# EAGLE schematic 0606_RGB_Clock (EAGLE 5.10)

## Sheet 1 of 3
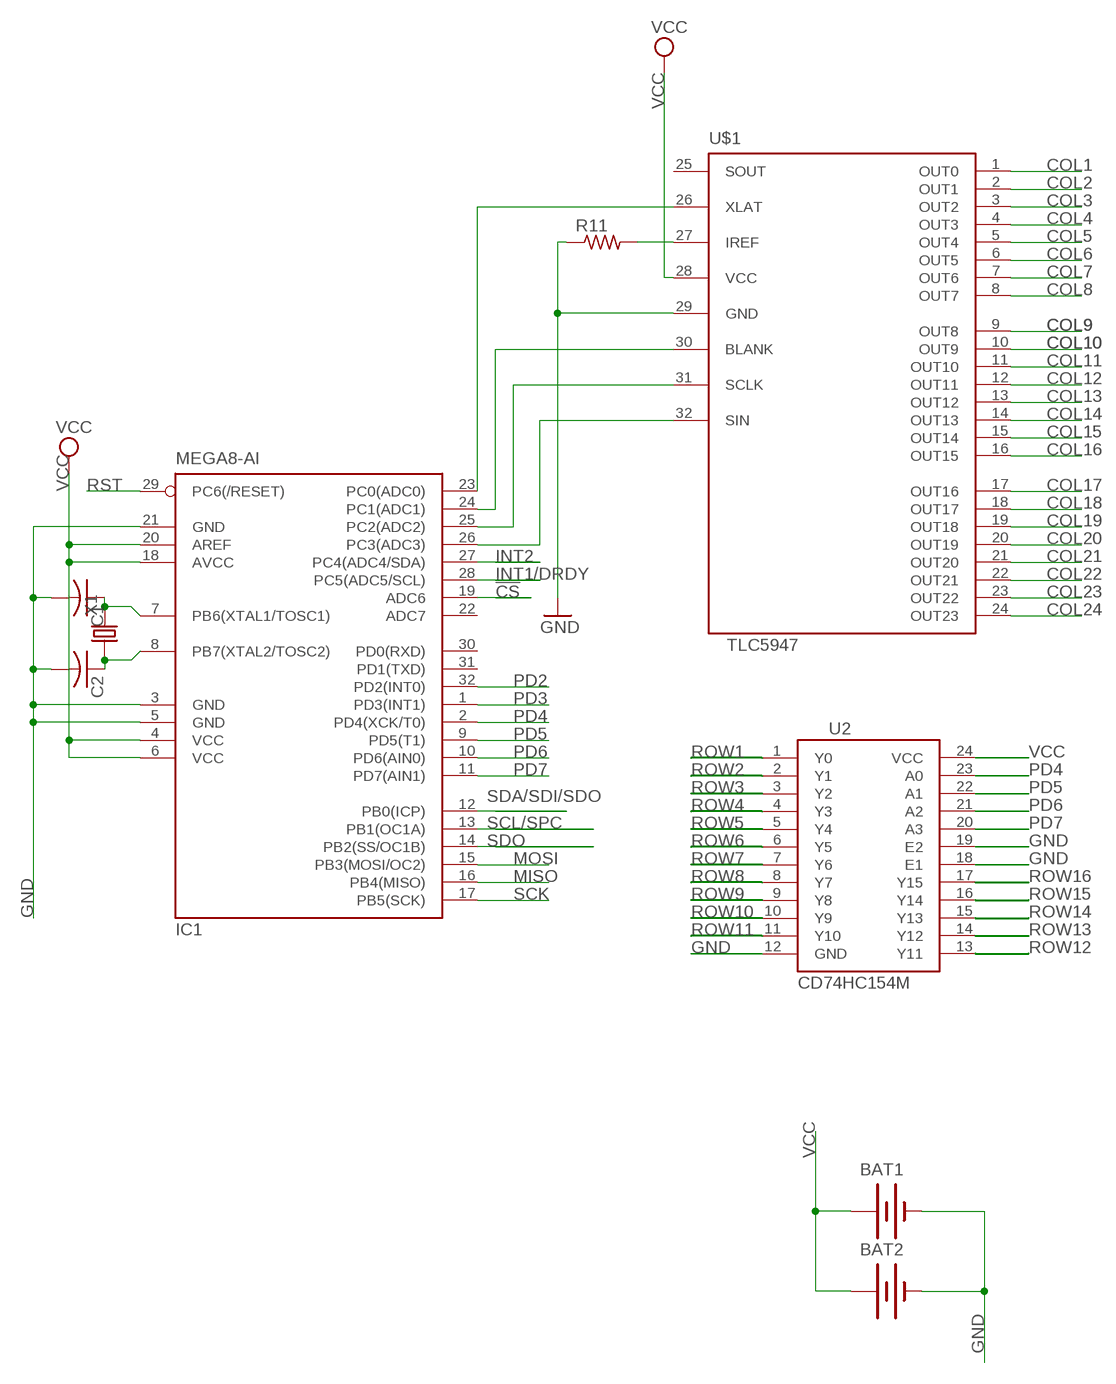
[diagram p0: schematic, sheet 1]

### Parts
BAT1  BATTERY20SMD  [BATTCON_20MM]
BAT2  BATTERY20SMD  [BATTCON_20MM]
C1  C-USC0805  [C0805]
C2  C-USC0805  [C0805]
IC1  MEGA8-AI  [TQFP32-08]
R11  R-US_R0805  [R0805]
U2  CD74HC154M  [SO-24DW]
U$1  TLC5947  [QFN32]
X1  CRYSTAL-5032  [5032]

### Nets
!CS: IC1.19(ADC6) ; also sheet 3
COL1: U$1.1(OUT0) ; also sheet 2
COL2: U$1.2(OUT1) ; also sheet 2
COL3: U$1.3(OUT2) ; also sheet 2
COL4: U$1.4(OUT3) ; also sheet 2
COL5: U$1.5(OUT4) ; also sheet 2
COL6: U$1.6(OUT5) ; also sheet 2
COL7: U$1.7(OUT6) ; also sheet 2
COL8: U$1.8(OUT7) ; also sheet 2
COL9: U$1.9(OUT8) ; also sheet 2
COL10: U$1.10(OUT9) ; also sheet 2
COL11: U$1.11(OUT10) ; also sheet 2
COL12: U$1.12(OUT11) ; also sheet 2
COL13: U$1.13(OUT12) ; also sheet 2
COL14: U$1.14(OUT13) ; also sheet 2
COL15: U$1.15(OUT14) ; also sheet 2
COL16: U$1.16(OUT15) ; also sheet 2
COL17: U$1.17(OUT16) ; also sheet 2
COL18: U$1.18(OUT17) ; also sheet 2
COL19: U$1.19(OUT18) ; also sheet 2
COL20: U$1.20(OUT19) ; also sheet 2
COL21: U$1.21(OUT20) ; also sheet 2
COL22: U$1.22(OUT21) ; also sheet 2
COL23: U$1.23(OUT22) ; also sheet 2
COL24: U$1.24(OUT23) ; also sheet 2
GND: BAT1.2(-) BAT2.2(-) C1.2 C2.2 IC1.3(GND) IC1.5(GND) IC1.21(GND) R11.1 U2.12(GND) U2.18(E1) U2.19(E2) U$1.29(GND) ; also sheet 3
INT1/DRDY: IC1.28(PC5(ADC5/SCL)) ; also sheet 3
INT2: IC1.27(PC4(ADC4/SDA)) ; also sheet 3
MISO: IC1.16(PB4(MISO)) ; also sheet 3
MOSI: IC1.15(PB3(MOSI/OC2)) ; also sheet 3
N$7: C1.1 IC1.7(PB6(XTAL1/TOSC1)) X1.2
N$8: C2.1 IC1.8(PB7(XTAL2/TOSC2)) X1.1
N$9: IC1.23(PC0(ADC0)) U$1.26(XLAT)
N$10: IC1.24(PC1(ADC1)) U$1.30(BLANK)
N$11: IC1.25(PC2(ADC2)) U$1.31(SCLK)
N$12: IC1.26(PC3(ADC3)) U$1.32(SIN)
N$13: R11.2 U$1.27(IREF)
PD2: IC1.32(PD2(INT0)) ; also sheet 3
PD3: IC1.1(PD3(INT1)) ; also sheet 3
PD4: IC1.2(PD4(XCK/T0)) U2.23(A0)
PD5: IC1.9(PD5(T1)) U2.22(A1)
PD6: IC1.10(PD6(AIN0)) U2.21(A2)
PD7: IC1.11(PD7(AIN1)) U2.20(A3)
ROW1: U2.1(Y0) ; also sheet 2
ROW2: U2.2(Y1) ; also sheet 2
ROW3: U2.3(Y2) ; also sheet 2
ROW4: U2.4(Y3) ; also sheet 2
ROW5: U2.5(Y4) ; also sheet 2
ROW6: U2.6(Y5) ; also sheet 2
ROW7: U2.7(Y6) ; also sheet 2
ROW8: U2.8(Y7) ; also sheet 2
ROW9: U2.9(Y8) ; also sheet 2
ROW10: U2.10(Y9)
ROW11: U2.11(Y10)
ROW12: U2.13(Y11)
ROW13: U2.14(Y12)
ROW14: U2.15(Y13)
ROW15: U2.16(Y14)
ROW16: U2.17(Y15)
RST: IC1.29(PC6(/RESET)) ; also sheet 3
SCK: IC1.17(PB5(SCK)) ; also sheet 3
SCL/SPC: IC1.13(PB1(OC1A)) ; also sheet 3
SDA/SDI/SDO: IC1.12(PB0(ICP)) ; also sheet 3
SDO: IC1.14(PB2(SS/OC1B)) ; also sheet 3
VCC: BAT1.1(+) BAT2.1(+) IC1.4(VCC) IC1.6(VCC) IC1.18(AVCC) IC1.20(AREF) U2.24(VCC) U$1.28(VCC) ; also sheet 2,3
Unconnected: IC1.22(ADC7) IC1.30(PD0(RXD)) IC1.31(PD1(TXD)) U$1.25(SOUT)

## Sheet 2 of 3
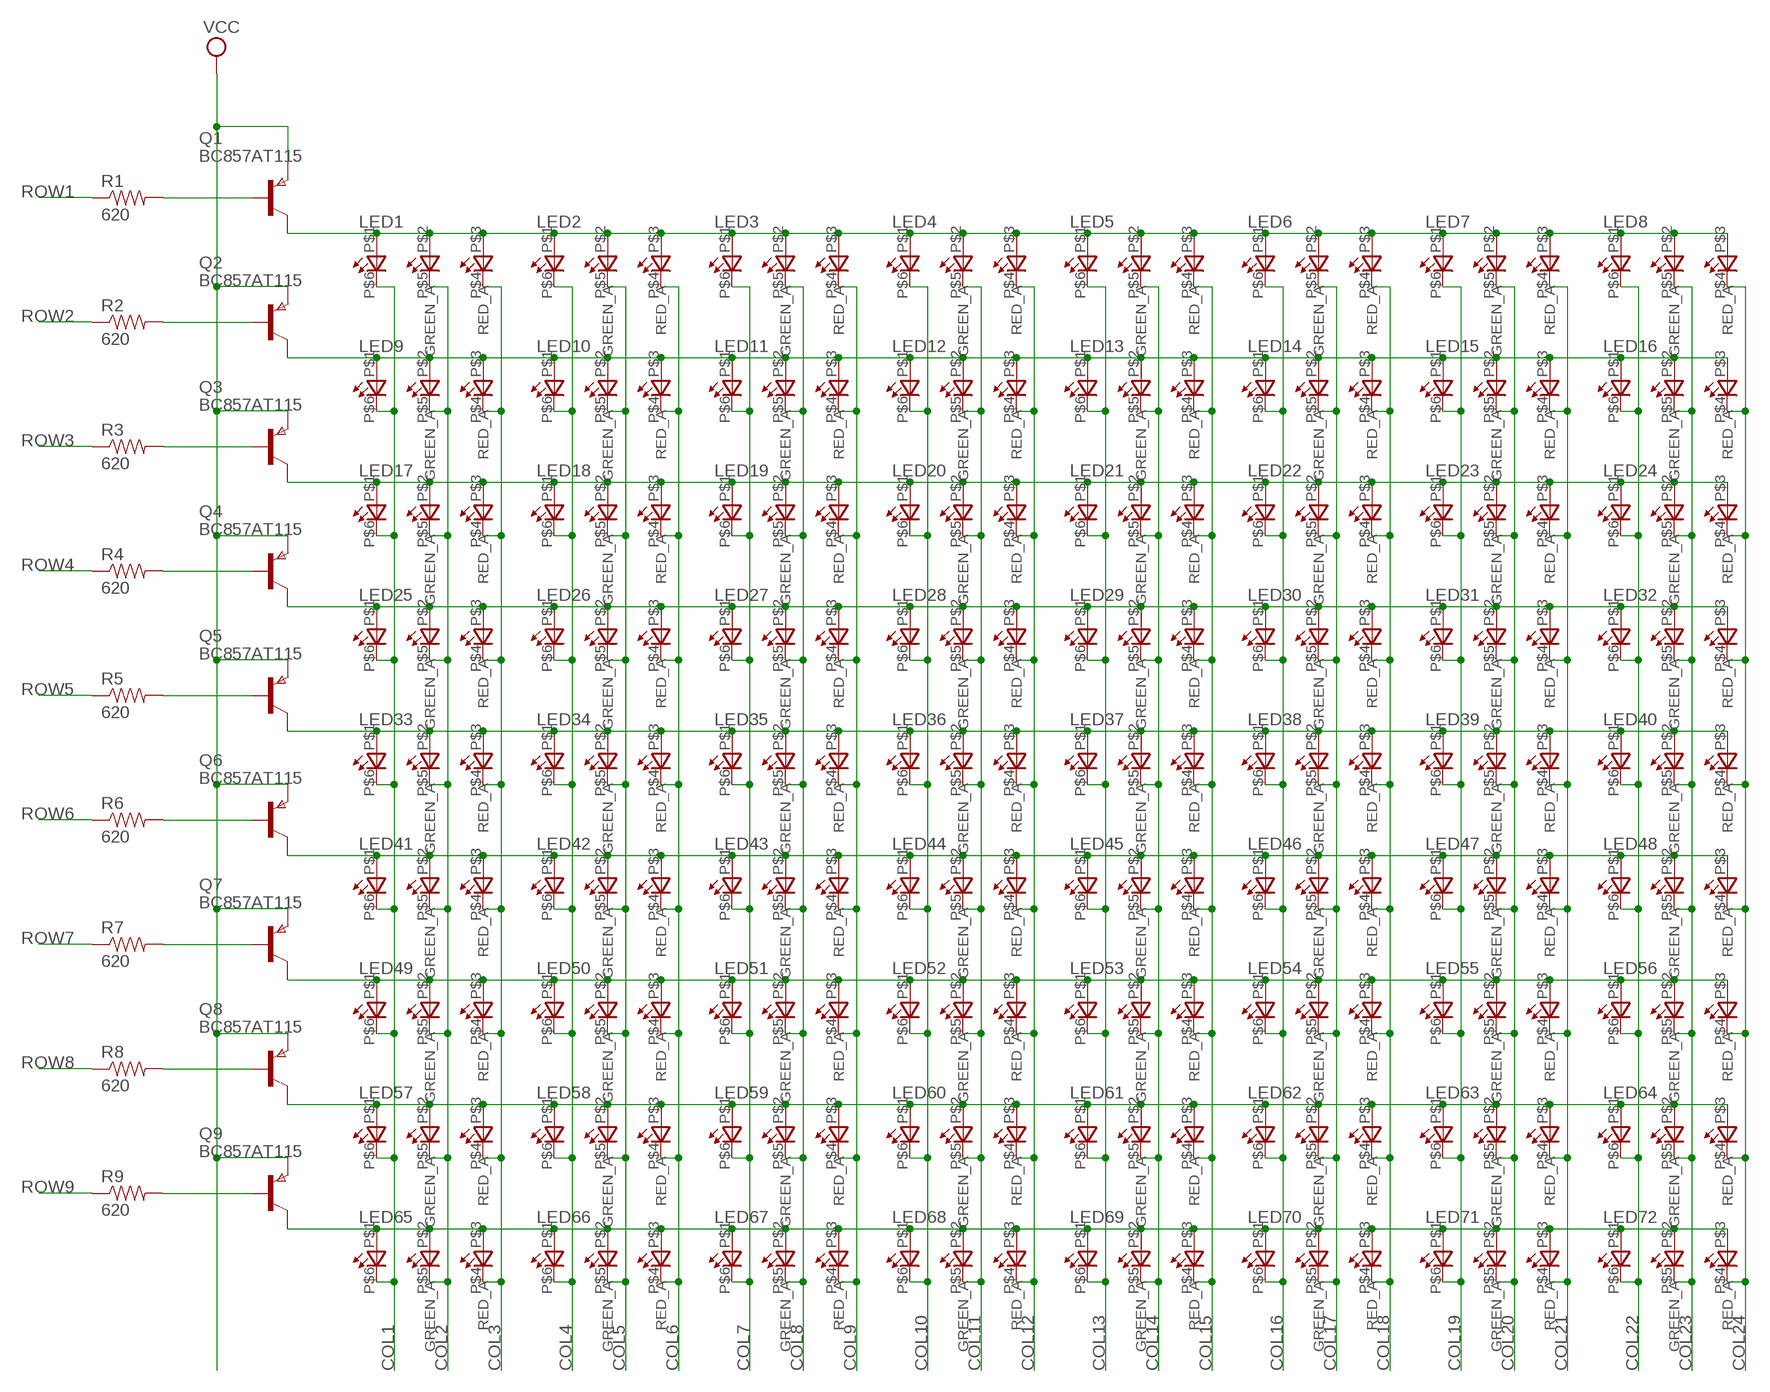
[diagram p1: schematic, sheet 2]

### Parts
LED1  0606_RGB_LED  [0606_LED]
LED2  0606_RGB_LED  [0606_LED]
LED3  0606_RGB_LED  [0606_LED]
LED4  0606_RGB_LED  [0606_LED]
LED5  0606_RGB_LED  [0606_LED]
LED6  0606_RGB_LED  [0606_LED]
LED7  0606_RGB_LED  [0606_LED]
LED8  0606_RGB_LED  [0606_LED]
LED9  0606_RGB_LED  [0606_LED]
LED10  0606_RGB_LED  [0606_LED]
LED11  0606_RGB_LED  [0606_LED]
LED12  0606_RGB_LED  [0606_LED]
LED13  0606_RGB_LED  [0606_LED]
LED14  0606_RGB_LED  [0606_LED]
LED15  0606_RGB_LED  [0606_LED]
LED16  0606_RGB_LED  [0606_LED]
LED17  0606_RGB_LED  [0606_LED]
LED18  0606_RGB_LED  [0606_LED]
LED19  0606_RGB_LED  [0606_LED]
LED20  0606_RGB_LED  [0606_LED]
LED21  0606_RGB_LED  [0606_LED]
LED22  0606_RGB_LED  [0606_LED]
LED23  0606_RGB_LED  [0606_LED]
LED24  0606_RGB_LED  [0606_LED]
LED25  0606_RGB_LED  [0606_LED]
LED26  0606_RGB_LED  [0606_LED]
LED27  0606_RGB_LED  [0606_LED]
LED28  0606_RGB_LED  [0606_LED]
LED29  0606_RGB_LED  [0606_LED]
LED30  0606_RGB_LED  [0606_LED]
LED31  0606_RGB_LED  [0606_LED]
LED32  0606_RGB_LED  [0606_LED]
LED33  0606_RGB_LED  [0606_LED]
LED34  0606_RGB_LED  [0606_LED]
LED35  0606_RGB_LED  [0606_LED]
LED36  0606_RGB_LED  [0606_LED]
LED37  0606_RGB_LED  [0606_LED]
LED38  0606_RGB_LED  [0606_LED]
LED39  0606_RGB_LED  [0606_LED]
LED40  0606_RGB_LED  [0606_LED]
LED41  0606_RGB_LED  [0606_LED]
LED42  0606_RGB_LED  [0606_LED]
LED43  0606_RGB_LED  [0606_LED]
LED44  0606_RGB_LED  [0606_LED]
LED45  0606_RGB_LED  [0606_LED]
LED46  0606_RGB_LED  [0606_LED]
LED47  0606_RGB_LED  [0606_LED]
LED48  0606_RGB_LED  [0606_LED]
LED49  0606_RGB_LED  [0606_LED]
LED50  0606_RGB_LED  [0606_LED]
LED51  0606_RGB_LED  [0606_LED]
LED52  0606_RGB_LED  [0606_LED]
LED53  0606_RGB_LED  [0606_LED]
LED54  0606_RGB_LED  [0606_LED]
LED55  0606_RGB_LED  [0606_LED]
LED56  0606_RGB_LED  [0606_LED]
LED57  0606_RGB_LED  [0606_LED]
LED58  0606_RGB_LED  [0606_LED]
LED59  0606_RGB_LED  [0606_LED]
LED60  0606_RGB_LED  [0606_LED]
LED61  0606_RGB_LED  [0606_LED]
LED62  0606_RGB_LED  [0606_LED]
LED63  0606_RGB_LED  [0606_LED]
LED64  0606_RGB_LED  [0606_LED]
LED65  0606_RGB_LED  [0606_LED]
LED66  0606_RGB_LED  [0606_LED]
LED67  0606_RGB_LED  [0606_LED]
LED68  0606_RGB_LED  [0606_LED]
LED69  0606_RGB_LED  [0606_LED]
LED70  0606_RGB_LED  [0606_LED]
LED71  0606_RGB_LED  [0606_LED]
LED72  0606_RGB_LED  [0606_LED]
Q1  BC857AT115  PNPSOT323SOT416  [SOT416]
Q2  BC857AT115  PNPSOT323SOT416  [SOT416]
Q3  BC857AT115  PNPSOT323SOT416  [SOT416]
Q4  BC857AT115  PNPSOT323SOT416  [SOT416]
Q5  BC857AT115  PNPSOT323SOT416  [SOT416]
Q6  BC857AT115  PNPSOT323SOT416  [SOT416]
Q7  BC857AT115  PNPSOT323SOT416  [SOT416]
Q8  BC857AT115  PNPSOT323SOT416  [SOT416]
Q9  BC857AT115  PNPSOT323SOT416  [SOT416]
R1  620  SPARKFUN_RESISTOR0603-RES  [SPARKFUN_0603-RES]
R2  620  SPARKFUN_RESISTOR0603-RES  [SPARKFUN_0603-RES]
R3  620  SPARKFUN_RESISTOR0603-RES  [SPARKFUN_0603-RES]
R4  620  SPARKFUN_RESISTOR0603-RES  [SPARKFUN_0603-RES]
R5  620  SPARKFUN_RESISTOR0603-RES  [SPARKFUN_0603-RES]
R6  620  SPARKFUN_RESISTOR0603-RES  [SPARKFUN_0603-RES]
R7  620  SPARKFUN_RESISTOR0603-RES  [SPARKFUN_0603-RES]
R8  620  SPARKFUN_RESISTOR0603-RES  [SPARKFUN_0603-RES]
R9  620  SPARKFUN_RESISTOR0603-RES  [SPARKFUN_0603-RES]

### Nets
COL1: LED1.P$6(C_BLUE) LED9.P$6(C_BLUE) LED17.P$6(C_BLUE) LED25.P$6(C_BLUE) LED33.P$6(C_BLUE) LED41.P$6(C_BLUE) LED49.P$6(C_BLUE) LED57.P$6(C_BLUE) LED65.P$6(C_BLUE) ; also sheet 1
COL2: LED1.P$5(C_GREEN) LED9.P$5(C_GREEN) LED17.P$5(C_GREEN) LED25.P$5(C_GREEN) LED33.P$5(C_GREEN) LED41.P$5(C_GREEN) LED49.P$5(C_GREEN) LED57.P$5(C_GREEN) LED65.P$5(C_GREEN) ; also sheet 1
COL3: LED1.P$4(C_RED) LED9.P$4(C_RED) LED17.P$4(C_RED) LED25.P$4(C_RED) LED33.P$4(C_RED) LED41.P$4(C_RED) LED49.P$4(C_RED) LED57.P$4(C_RED) LED65.P$4(C_RED) ; also sheet 1
COL4: LED2.P$6(C_BLUE) LED10.P$6(C_BLUE) LED18.P$6(C_BLUE) LED26.P$6(C_BLUE) LED34.P$6(C_BLUE) LED42.P$6(C_BLUE) LED50.P$6(C_BLUE) LED58.P$6(C_BLUE) LED66.P$6(C_BLUE) ; also sheet 1
COL5: LED2.P$5(C_GREEN) LED10.P$5(C_GREEN) LED18.P$5(C_GREEN) LED26.P$5(C_GREEN) LED34.P$5(C_GREEN) LED42.P$5(C_GREEN) LED50.P$5(C_GREEN) LED58.P$5(C_GREEN) LED66.P$5(C_GREEN) ; also sheet 1
COL6: LED2.P$4(C_RED) LED10.P$4(C_RED) LED18.P$4(C_RED) LED26.P$4(C_RED) LED34.P$4(C_RED) LED42.P$4(C_RED) LED50.P$4(C_RED) LED58.P$4(C_RED) LED66.P$4(C_RED) ; also sheet 1
COL7: LED3.P$6(C_BLUE) LED11.P$6(C_BLUE) LED19.P$6(C_BLUE) LED27.P$6(C_BLUE) LED35.P$6(C_BLUE) LED43.P$6(C_BLUE) LED51.P$6(C_BLUE) LED59.P$6(C_BLUE) LED67.P$6(C_BLUE) ; also sheet 1
COL8: LED3.P$5(C_GREEN) LED11.P$5(C_GREEN) LED19.P$5(C_GREEN) LED27.P$5(C_GREEN) LED35.P$5(C_GREEN) LED43.P$5(C_GREEN) LED51.P$5(C_GREEN) LED59.P$5(C_GREEN) LED67.P$5(C_GREEN) ; also sheet 1
COL9: LED3.P$4(C_RED) LED11.P$4(C_RED) LED19.P$4(C_RED) LED27.P$4(C_RED) LED35.P$4(C_RED) LED43.P$4(C_RED) LED51.P$4(C_RED) LED59.P$4(C_RED) LED67.P$4(C_RED) ; also sheet 1
COL10: LED4.P$6(C_BLUE) LED12.P$6(C_BLUE) LED20.P$6(C_BLUE) LED28.P$6(C_BLUE) LED36.P$6(C_BLUE) LED44.P$6(C_BLUE) LED52.P$6(C_BLUE) LED60.P$6(C_BLUE) LED68.P$6(C_BLUE) ; also sheet 1
COL11: LED4.P$5(C_GREEN) LED12.P$5(C_GREEN) LED20.P$5(C_GREEN) LED28.P$5(C_GREEN) LED36.P$5(C_GREEN) LED44.P$5(C_GREEN) LED52.P$5(C_GREEN) LED60.P$5(C_GREEN) LED68.P$5(C_GREEN) ; also sheet 1
COL12: LED4.P$4(C_RED) LED12.P$4(C_RED) LED20.P$4(C_RED) LED28.P$4(C_RED) LED36.P$4(C_RED) LED44.P$4(C_RED) LED52.P$4(C_RED) LED60.P$4(C_RED) LED68.P$4(C_RED) ; also sheet 1
COL13: LED5.P$6(C_BLUE) LED13.P$6(C_BLUE) LED21.P$6(C_BLUE) LED29.P$6(C_BLUE) LED37.P$6(C_BLUE) LED45.P$6(C_BLUE) LED53.P$6(C_BLUE) LED61.P$6(C_BLUE) LED69.P$6(C_BLUE) ; also sheet 1
COL14: LED5.P$5(C_GREEN) LED13.P$5(C_GREEN) LED21.P$5(C_GREEN) LED29.P$5(C_GREEN) LED37.P$5(C_GREEN) LED45.P$5(C_GREEN) LED53.P$5(C_GREEN) LED61.P$5(C_GREEN) LED69.P$5(C_GREEN) ; also sheet 1
COL15: LED5.P$4(C_RED) LED13.P$4(C_RED) LED21.P$4(C_RED) LED29.P$4(C_RED) LED37.P$4(C_RED) LED45.P$4(C_RED) LED53.P$4(C_RED) LED61.P$4(C_RED) LED69.P$4(C_RED) ; also sheet 1
COL16: LED6.P$6(C_BLUE) LED14.P$6(C_BLUE) LED22.P$6(C_BLUE) LED30.P$6(C_BLUE) LED38.P$6(C_BLUE) LED46.P$6(C_BLUE) LED54.P$6(C_BLUE) LED62.P$6(C_BLUE) LED70.P$6(C_BLUE) ; also sheet 1
COL17: LED6.P$5(C_GREEN) LED14.P$5(C_GREEN) LED22.P$5(C_GREEN) LED30.P$5(C_GREEN) LED38.P$5(C_GREEN) LED46.P$5(C_GREEN) LED54.P$5(C_GREEN) LED62.P$5(C_GREEN) LED70.P$5(C_GREEN) ; also sheet 1
COL18: LED6.P$4(C_RED) LED14.P$4(C_RED) LED22.P$4(C_RED) LED30.P$4(C_RED) LED38.P$4(C_RED) LED46.P$4(C_RED) LED54.P$4(C_RED) LED62.P$4(C_RED) LED70.P$4(C_RED) ; also sheet 1
COL19: LED7.P$6(C_BLUE) LED15.P$6(C_BLUE) LED23.P$6(C_BLUE) LED31.P$6(C_BLUE) LED39.P$6(C_BLUE) LED47.P$6(C_BLUE) LED55.P$6(C_BLUE) LED63.P$6(C_BLUE) LED71.P$6(C_BLUE) ; also sheet 1
COL20: LED7.P$5(C_GREEN) LED15.P$5(C_GREEN) LED23.P$5(C_GREEN) LED31.P$5(C_GREEN) LED39.P$5(C_GREEN) LED47.P$5(C_GREEN) LED55.P$5(C_GREEN) LED63.P$5(C_GREEN) LED71.P$5(C_GREEN) ; also sheet 1
COL21: LED7.P$4(C_RED) LED15.P$4(C_RED) LED23.P$4(C_RED) LED31.P$4(C_RED) LED39.P$4(C_RED) LED47.P$4(C_RED) LED55.P$4(C_RED) LED63.P$4(C_RED) LED71.P$4(C_RED) ; also sheet 1
COL22: LED8.P$6(C_BLUE) LED16.P$6(C_BLUE) LED24.P$6(C_BLUE) LED32.P$6(C_BLUE) LED40.P$6(C_BLUE) LED48.P$6(C_BLUE) LED56.P$6(C_BLUE) LED64.P$6(C_BLUE) LED72.P$6(C_BLUE) ; also sheet 1
COL23: LED8.P$5(C_GREEN) LED16.P$5(C_GREEN) LED24.P$5(C_GREEN) LED32.P$5(C_GREEN) LED40.P$5(C_GREEN) LED48.P$5(C_GREEN) LED56.P$5(C_GREEN) LED64.P$5(C_GREEN) LED72.P$5(C_GREEN) ; also sheet 1
COL24: LED8.P$4(C_RED) LED16.P$4(C_RED) LED24.P$4(C_RED) LED32.P$4(C_RED) LED40.P$4(C_RED) LED48.P$4(C_RED) LED56.P$4(C_RED) LED64.P$4(C_RED) LED72.P$4(C_RED) ; also sheet 1
LINE1: LED1.P$1(BLUE_A) LED1.P$2(GREEN_A) LED1.P$3(RED_A) LED2.P$1(BLUE_A) LED2.P$2(GREEN_A) LED2.P$3(RED_A) LED3.P$1(BLUE_A) LED3.P$2(GREEN_A) LED3.P$3(RED_A) LED4.P$1(BLUE_A) LED4.P$2(GREEN_A) LED4.P$3(RED_A) LED5.P$1(BLUE_A) LED5.P$2(GREEN_A) LED5.P$3(RED_A) LED6.P$1(BLUE_A) LED6.P$2(GREEN_A) LED6.P$3(RED_A) LED7.P$1(BLUE_A) LED7.P$2(GREEN_A) LED7.P$3(RED_A) LED8.P$1(BLUE_A) LED8.P$2(GREEN_A) LED8.P$3(RED_A) Q1.1(C)
LINE2: LED9.P$1(BLUE_A) LED9.P$2(GREEN_A) LED9.P$3(RED_A) LED10.P$1(BLUE_A) LED10.P$2(GREEN_A) LED10.P$3(RED_A) LED11.P$1(BLUE_A) LED11.P$2(GREEN_A) LED11.P$3(RED_A) LED12.P$1(BLUE_A) LED12.P$2(GREEN_A) LED12.P$3(RED_A) LED13.P$1(BLUE_A) LED13.P$2(GREEN_A) LED13.P$3(RED_A) LED14.P$1(BLUE_A) LED14.P$2(GREEN_A) LED14.P$3(RED_A) LED15.P$1(BLUE_A) LED15.P$2(GREEN_A) LED15.P$3(RED_A) LED16.P$1(BLUE_A) LED16.P$2(GREEN_A) LED16.P$3(RED_A) Q2.1(C)
LINE3: LED17.P$1(BLUE_A) LED17.P$2(GREEN_A) LED17.P$3(RED_A) LED18.P$1(BLUE_A) LED18.P$2(GREEN_A) LED18.P$3(RED_A) LED19.P$1(BLUE_A) LED19.P$2(GREEN_A) LED19.P$3(RED_A) LED20.P$1(BLUE_A) LED20.P$2(GREEN_A) LED20.P$3(RED_A) LED21.P$1(BLUE_A) LED21.P$2(GREEN_A) LED21.P$3(RED_A) LED22.P$1(BLUE_A) LED22.P$2(GREEN_A) LED22.P$3(RED_A) LED23.P$1(BLUE_A) LED23.P$2(GREEN_A) LED23.P$3(RED_A) LED24.P$1(BLUE_A) LED24.P$2(GREEN_A) LED24.P$3(RED_A) Q3.1(C)
LINE4: LED25.P$1(BLUE_A) LED25.P$2(GREEN_A) LED25.P$3(RED_A) LED26.P$1(BLUE_A) LED26.P$2(GREEN_A) LED26.P$3(RED_A) LED27.P$1(BLUE_A) LED27.P$2(GREEN_A) LED27.P$3(RED_A) LED28.P$1(BLUE_A) LED28.P$2(GREEN_A) LED28.P$3(RED_A) LED29.P$1(BLUE_A) LED29.P$2(GREEN_A) LED29.P$3(RED_A) LED30.P$1(BLUE_A) LED30.P$2(GREEN_A) LED30.P$3(RED_A) LED31.P$1(BLUE_A) LED31.P$2(GREEN_A) LED31.P$3(RED_A) LED32.P$1(BLUE_A) LED32.P$2(GREEN_A) LED32.P$3(RED_A) Q4.1(C)
LINE5: LED33.P$1(BLUE_A) LED33.P$2(GREEN_A) LED33.P$3(RED_A) LED34.P$1(BLUE_A) LED34.P$2(GREEN_A) LED34.P$3(RED_A) LED35.P$1(BLUE_A) LED35.P$2(GREEN_A) LED35.P$3(RED_A) LED36.P$1(BLUE_A) LED36.P$2(GREEN_A) LED36.P$3(RED_A) LED37.P$1(BLUE_A) LED37.P$2(GREEN_A) LED37.P$3(RED_A) LED38.P$1(BLUE_A) LED38.P$2(GREEN_A) LED38.P$3(RED_A) LED39.P$1(BLUE_A) LED39.P$2(GREEN_A) LED39.P$3(RED_A) LED40.P$1(BLUE_A) LED40.P$2(GREEN_A) LED40.P$3(RED_A) Q5.1(C)
LINE6: LED41.P$1(BLUE_A) LED41.P$2(GREEN_A) LED41.P$3(RED_A) LED42.P$1(BLUE_A) LED42.P$2(GREEN_A) LED42.P$3(RED_A) LED43.P$1(BLUE_A) LED43.P$2(GREEN_A) LED43.P$3(RED_A) LED44.P$1(BLUE_A) LED44.P$2(GREEN_A) LED44.P$3(RED_A) LED45.P$1(BLUE_A) LED45.P$2(GREEN_A) LED45.P$3(RED_A) LED46.P$1(BLUE_A) LED46.P$2(GREEN_A) LED46.P$3(RED_A) LED47.P$1(BLUE_A) LED47.P$2(GREEN_A) LED47.P$3(RED_A) LED48.P$1(BLUE_A) LED48.P$2(GREEN_A) LED48.P$3(RED_A) Q6.1(C)
LINE7: LED49.P$1(BLUE_A) LED49.P$2(GREEN_A) LED49.P$3(RED_A) LED50.P$1(BLUE_A) LED50.P$2(GREEN_A) LED50.P$3(RED_A) LED51.P$1(BLUE_A) LED51.P$2(GREEN_A) LED51.P$3(RED_A) LED52.P$1(BLUE_A) LED52.P$2(GREEN_A) LED52.P$3(RED_A) LED53.P$1(BLUE_A) LED53.P$2(GREEN_A) LED53.P$3(RED_A) LED54.P$1(BLUE_A) LED54.P$2(GREEN_A) LED54.P$3(RED_A) LED55.P$1(BLUE_A) LED55.P$2(GREEN_A) LED55.P$3(RED_A) LED56.P$1(BLUE_A) LED56.P$2(GREEN_A) LED56.P$3(RED_A) Q7.1(C)
LINE8: LED57.P$1(BLUE_A) LED57.P$2(GREEN_A) LED57.P$3(RED_A) LED58.P$1(BLUE_A) LED58.P$2(GREEN_A) LED58.P$3(RED_A) LED59.P$1(BLUE_A) LED59.P$2(GREEN_A) LED59.P$3(RED_A) LED60.P$1(BLUE_A) LED60.P$2(GREEN_A) LED60.P$3(RED_A) LED61.P$1(BLUE_A) LED61.P$2(GREEN_A) LED61.P$3(RED_A) LED62.P$1(BLUE_A) LED62.P$2(GREEN_A) LED62.P$3(RED_A) LED63.P$1(BLUE_A) LED63.P$2(GREEN_A) LED63.P$3(RED_A) LED64.P$1(BLUE_A) LED64.P$2(GREEN_A) LED64.P$3(RED_A) Q8.1(C)
LINE9: LED65.P$1(BLUE_A) LED65.P$2(GREEN_A) LED65.P$3(RED_A) LED66.P$1(BLUE_A) LED66.P$2(GREEN_A) LED66.P$3(RED_A) LED67.P$1(BLUE_A) LED67.P$2(GREEN_A) LED67.P$3(RED_A) LED68.P$1(BLUE_A) LED68.P$2(GREEN_A) LED68.P$3(RED_A) LED69.P$1(BLUE_A) LED69.P$2(GREEN_A) LED69.P$3(RED_A) LED70.P$1(BLUE_A) LED70.P$2(GREEN_A) LED70.P$3(RED_A) LED71.P$1(BLUE_A) LED71.P$2(GREEN_A) LED71.P$3(RED_A) LED72.P$1(BLUE_A) LED72.P$2(GREEN_A) LED72.P$3(RED_A) Q9.1(C)
N$2: Q1.2(B) R1.2
N$34: Q2.2(B) R2.2
N$59: Q3.2(B) R3.2
N$60: Q6.2(B) R6.2
N$61: Q7.2(B) R7.2
N$62: Q8.2(B) R8.2
N$63: Q5.2(B) R5.2
N$84: Q4.2(B) R4.2
N$89: Q9.2(B) R9.2
ROW1: R1.1 ; also sheet 1
ROW2: R2.1 ; also sheet 1
ROW3: R3.1 ; also sheet 1
ROW4: R4.1 ; also sheet 1
ROW5: R5.1 ; also sheet 1
ROW6: R6.1 ; also sheet 1
ROW7: R7.1 ; also sheet 1
ROW8: R8.1 ; also sheet 1
ROW9: R9.1 ; also sheet 1
VCC: Q1.3(E) Q2.3(E) Q3.3(E) Q4.3(E) Q5.3(E) Q6.3(E) Q7.3(E) Q8.3(E) Q9.3(E) ; also sheet 1,3

## Sheet 3 of 3
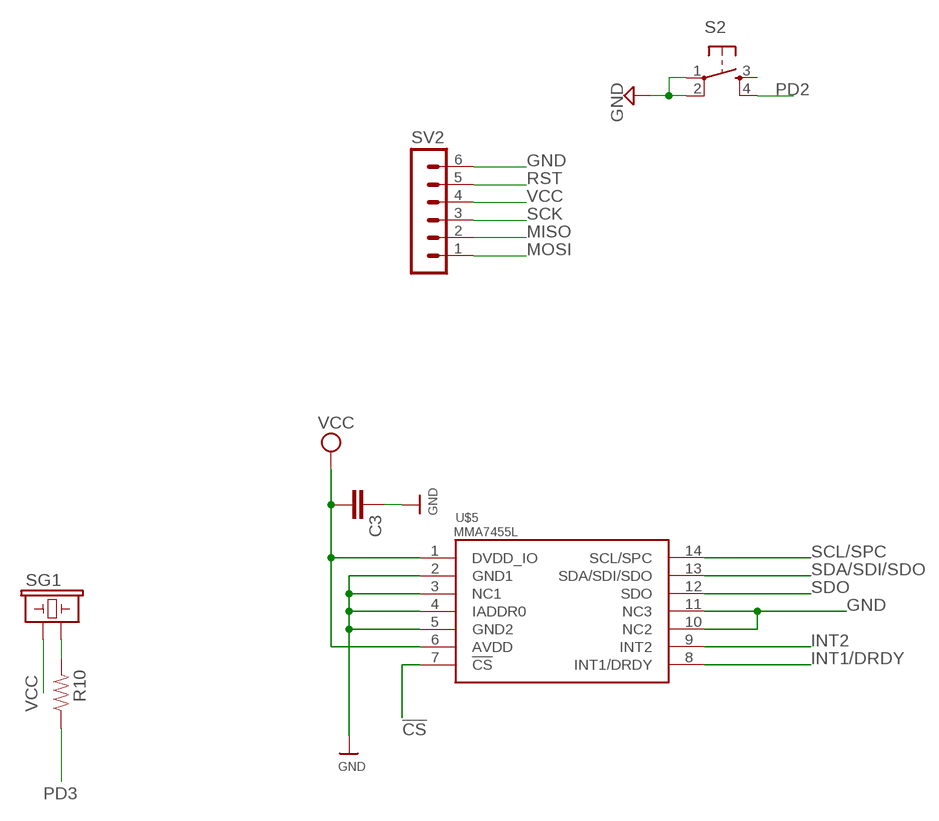
[diagram p2: schematic, sheet 3]

### Parts
C3  CAP0805  [0805]
R10  RESISTOR1206  [1206]
S2  TAC_SWITCHSMD  [TACTILE_SWITCH_SMD]
SG1  BUZZERSMD2  [BUZZER-CCV]
SV2  MA06-1  [MA06-1]
U$5  MMA7455L  [LGA-14]

### Nets
!CS: U$5.7(!CS) ; also sheet 1
GND: C3.1 S2.1 S2.2 SV2.6 U$5.2(GND1) U$5.3(NC1) U$5.4(IADDR0) U$5.5(GND2) U$5.10(NC2) U$5.11(NC3) ; also sheet 1
INT1/DRDY: U$5.8(INT1/DRDY) ; also sheet 1
INT2: U$5.9(INT2) ; also sheet 1
MISO: SV2.2 ; also sheet 1
MOSI: SV2.1 ; also sheet 1
N$5: R10.2 SG1.-
PD2: S2.4 ; also sheet 1
PD3: R10.1 ; also sheet 1
RST: SV2.5 ; also sheet 1
SCK: SV2.3 ; also sheet 1
SCL/SPC: U$5.14(SCL/SPC) ; also sheet 1
SDA/SDI/SDO: U$5.13(SDA/SDI/SDO) ; also sheet 1
SDO: U$5.12(SDO) ; also sheet 1
VCC: C3.2 SG1.+ SV2.4 U$5.1(DVDD_IO) U$5.6(AVDD) ; also sheet 1,2
Unconnected: S2.3

## Library data of the parts
BAT1 BAT2 = SparkFun:BATTERY: Battery Holders Various common sizes : AA, AAA, 20mm coin cell and 12mm coin cell.
C1 C2 = rcl:C-US: CAPACITOR, American symbol
C3 = SparkFun:CAP: Capacitor Standard 0603 ceramic capacitor, and 0.1" leaded capacitor.
IC1 = atmel:MEGA8: MICROCONTROLLER 8 Kbytes FLASH, 1 kbytes SRAM, 512 bytes EEPROM, USART, 6-channel 10 bit ADC, 2-channel 8 bit ADC Pin compatible with Atmega48, ATMega88, ATMega168 Source: avr.lbr; MPN: ATMEGA8-16AU; OC_FARNELL: 9171371; OC_NEWARK: 73M8863
LED1-LED72 = lil_rgb:0606_RGB_LED
Q1-Q9 = zetex:PNPSOT323: PNP TRANSISTOR
R1-R9 = Nullspace:SPARKFUN_RESISTOR: Resistor Basic schematic elements and footprints for 0603, 1206, and PTH 1/10th watt (small) resistors.
R10 = SparkFun:RESISTOR: Resistor Basic schematic elements and footprints for 0603, 1206, and PTH 1/10th watt (small) resistors.
R11 = rcl:R-US_: RESISTOR, American symbol
S2 = SparkFun:TAC_SWITCH: Momentary Switch Button commonly used for reset or general input. Spark Fun Electronics SKU : COM-00097
SG1 = SparkFun:BUZZER: Buzzer 12mm Spark Fun Electronics SKU : Comp-Buzzer
SV2 = NSL:MA06-1: PIN HEADER
U2 = SparkFun:CD74HC154M: High-Speed CMOS Logic 4- to 16-Line Decoder/Demultiplexer
U$1 = lil_rgb:TLC5947
U$5 = MMA7455Lbreakoutboard-v1a:MMA7455L
X1 = NSL_MiniQuad:CRYSTAL*: CRYSTAL

## Net classes
0 default: width 0.254 mm